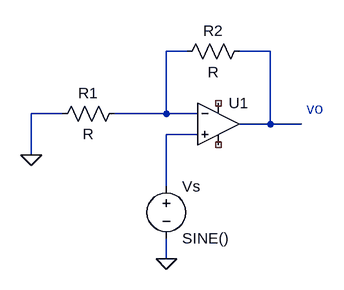
[diagram p0: schematic Q5 blank.asc]
Q5 blank.asc, the LTspice schematic file:
Version 4.1
SHEET 1 880 680
WIRE 192 64 160 64
WIRE 320 64 272 64
WIRE 0 160 -48 160
WIRE 160 160 160 64
WIRE 160 160 80 160
WIRE 208 160 160 160
WIRE 320 176 320 64
WIRE 320 176 272 176
WIRE 368 176 320 176
WIRE 208 192 160 192
WIRE -48 224 -48 160
WIRE 160 272 160 192
WIRE 160 384 160 352
FLAG 160 384 0
FLAG -48 224 0
SYMBOL OpAmps\\UniversalOpAmp1 240 176 R0
SYMATTR InstName U1
SYMBOL res 96 144 R90
WINDOW 0 0 56 VBottom 2
WINDOW 3 32 56 VTop 2
SYMATTR InstName R1
SYMBOL res 288 48 R90
WINDOW 0 0 56 VBottom 2
WINDOW 3 32 56 VTop 2
SYMATTR InstName R2
SYMBOL voltage 160 256 R0
WINDOW 123 0 0 Left 0
WINDOW 39 0 0 Left 0
SYMATTR InstName Vs
SYMATTR Value SINE()
TEXT 376 152 Left 2 ;vo

The netlist it stands for:
* Q5 blank.asc
X§U1 N003 N001 NC_01 NC_02 N002 level1 Avol=1Meg GBW=10Meg Vos=0 En=0 Enk=0 In=0 Ink=0 Rin=500Meg  ; pins In+ In- V+ V- OUT
R1 N001 0 R
R2 N002 N001 R
Vs N003 0 SINE()
* vo
.lib UniversalOpAmp1.lib
.backanno
.end